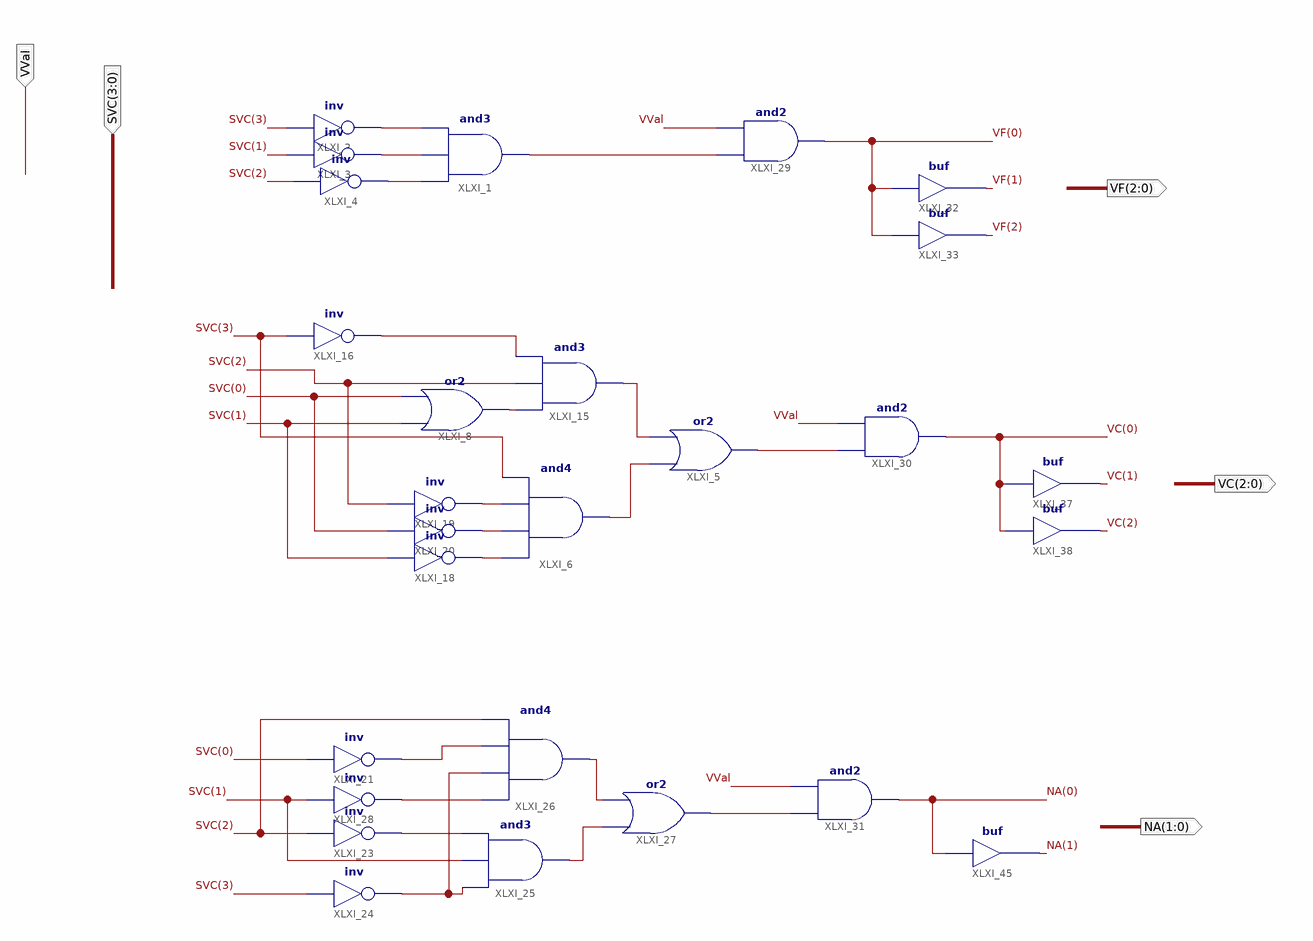
[diagram p0: schematic sheet 1]
// Xilinx ISE schematic Resultado_de_votacion.sch (spartan6) as structural Verilog: 27 symbols, 5 ports
module Resultado_de_votacion (
  input  [3:0] SVC,
  input  VVal,
  output [2:0] VF,
  output [2:0] VC,
  output [1:0] NA
);

  wire XLXN_2, XLXN_3, XLXN_4, XLXN_15, XLXN_17, XLXN_25, XLXN_26, XLXN_27, XLXN_28, XLXN_31, XLXN_39,
       XLXN_42, XLXN_44, XLXN_45, XLXN_46, XLXN_49, XLXN_50, XLXN_51, XLXN_52;

  and XLXI_1 (XLXN_50, XLXN_4, XLXN_3, XLXN_2);
  not XLXI_2 (XLXN_2, SVC[3]);
  not XLXI_3 (XLXN_3, SVC[1]);
  not XLXI_4 (XLXN_4, SVC[2]);
  or XLXI_5 (XLXN_51, XLXN_31, XLXN_28);
  and XLXI_6 (XLXN_31, XLXN_27, XLXN_26, XLXN_25, SVC[3]);
  or XLXI_8 (XLXN_15, SVC[1], SVC[0]);
  and XLXI_15 (XLXN_28, XLXN_15, SVC[2], XLXN_17);
  not XLXI_16 (XLXN_17, SVC[3]);
  not XLXI_18 (XLXN_27, SVC[1]);
  not XLXI_19 (XLXN_25, SVC[2]);
  not XLXI_20 (XLXN_26, SVC[0]);
  not XLXI_21 (XLXN_45, SVC[0]);
  not XLXI_23 (XLXN_39, SVC[2]);
  not XLXI_24 (XLXN_44, SVC[3]);
  and XLXI_25 (XLXN_49, XLXN_44, SVC[1], XLXN_39);
  and XLXI_26 (XLXN_46, XLXN_42, XLXN_44, XLXN_45, SVC[2]);
  or XLXI_27 (XLXN_52, XLXN_49, XLXN_46);
  not XLXI_28 (XLXN_42, SVC[1]);
  and XLXI_29 (VF[0], XLXN_50, VVal);
  buf XLXI_32 (VF[1], VF[0]);
  buf XLXI_33 (VF[2], VF[0]);
  and XLXI_30 (VC[0], XLXN_51, VVal);
  and XLXI_31 (NA[0], XLXN_52, VVal);
  buf XLXI_37 (VC[1], VC[0]);
  buf XLXI_38 (VC[2], VC[0]);
  buf XLXI_45 (NA[1], NA[0]);
endmodule
